# Altium project smart_car.PrjPcb
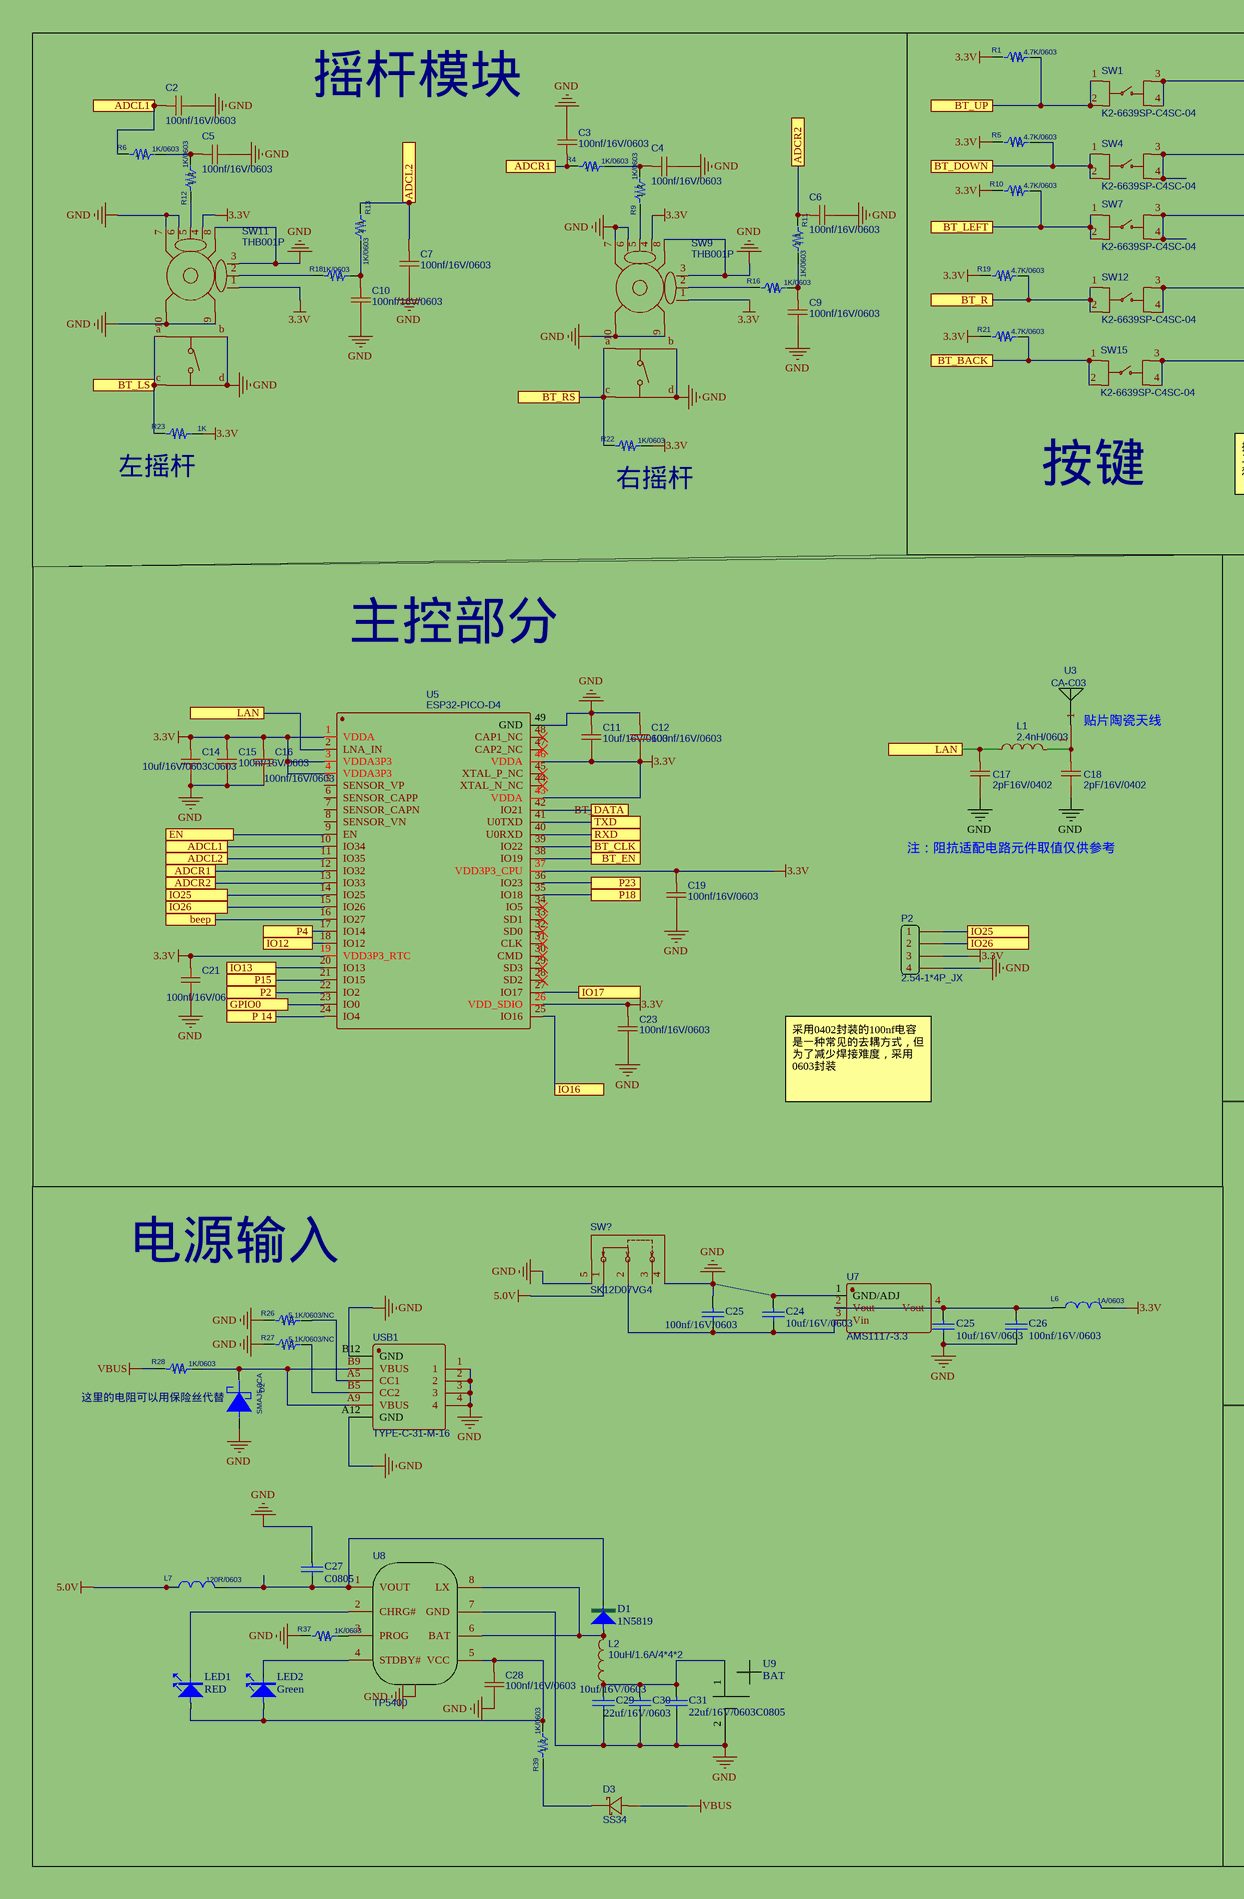
[diagram p0: 遥控器.SchDoc, left]
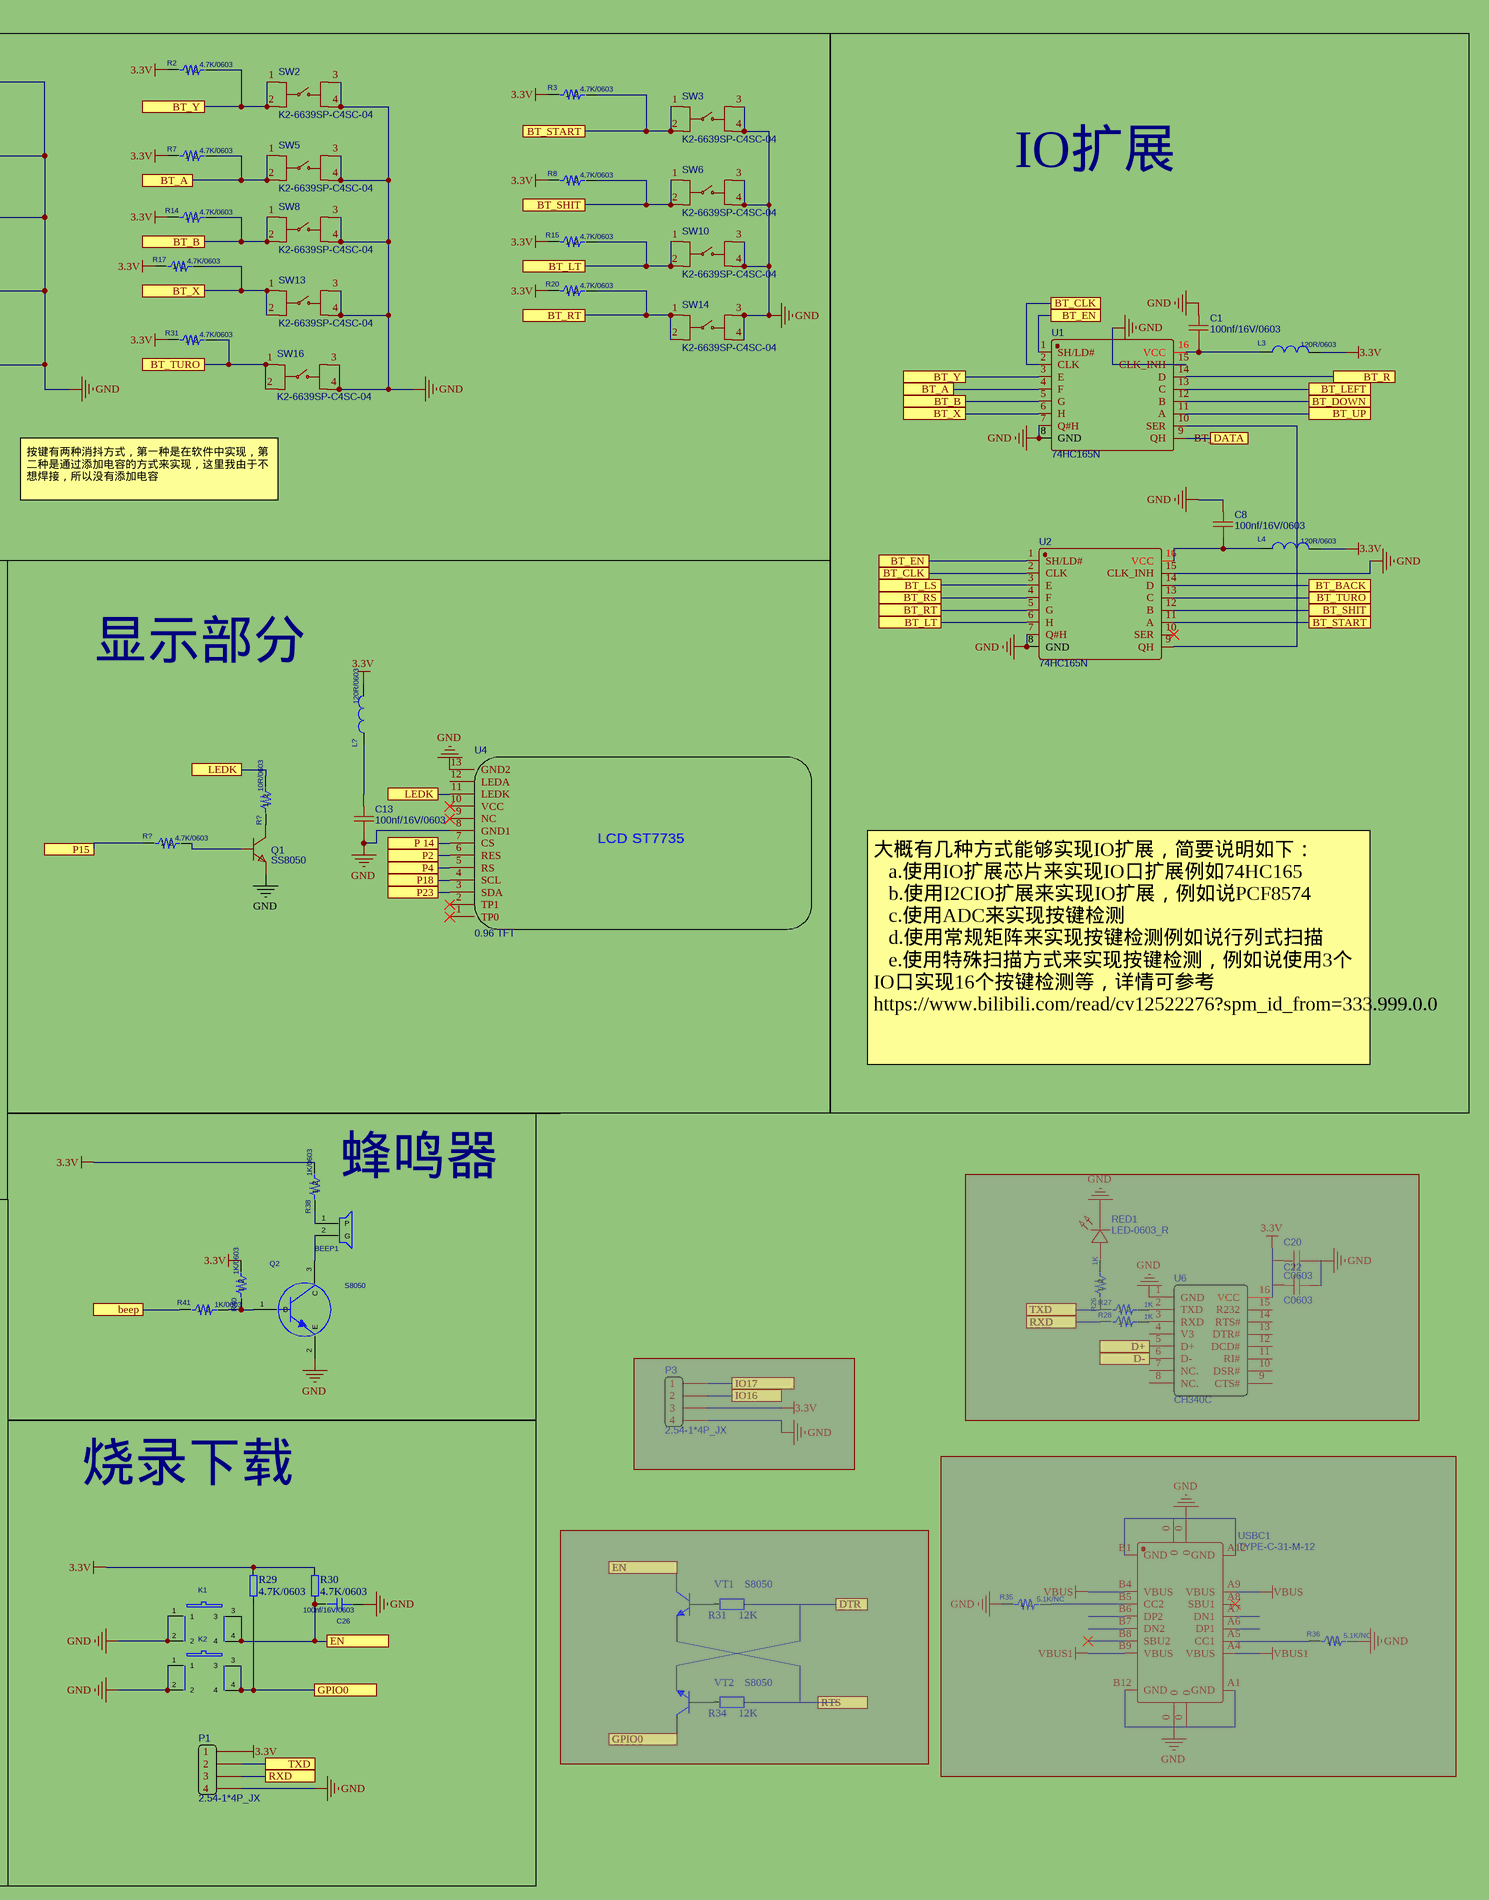
[diagram p1: 遥控器.SchDoc, right]
1 sheet, 127 parts. Net scope: flat (ports and power ports of the same name join across sheets).
Board files: PCB2.PcbDoc, PCB3.PcbDoc, 个人logo.PcbDoc

## Sheet 遥控器.SchDoc
size A2

### Parts
(Parts that share a designator on the sheet are numbered #1, #2 ... from top to bottom, then left to right.)
BEEP1  BEEP-9.5X5.5  [BEEP-9.5X5.5]  (value not drawn)
C1  100nf/16V/0603  [C0603]
C2  100nf/16V/0603  [C0603]
C3  100nf/16V/0603  [C0603]
C4  100nf/16V/0603  [C0603]
C5  100nf/16V/0603  [C0603]
C6  100nf/16V/0603  [C0603]
C7  100nf/16V/0603  [C0603]
C8  100nf/16V/0603  [C0603]
C9  100nf/16V/0603  [C0603]
C10  100nf/16V/0603  [C0603]
C11  10uf/16V/0603  [C0603]
C12  100nf/16V/0603  [C0603]
C13  100nf/16V/0603  [C0603]
C14  10uf/16V/0603C0603  [C0603]
C15  100nf/16V/0603  [C0603]
C16  100nf/16V/0603  [C0603]
C17  2pF16V/0402  [C0402]
C18  2pF/16V/0402  [C0402]
C19  100nf/16V/0603  [C0603]
C20  C0603  [C0603]  (masked out: inside a compile mask, not in the netlist)
C21  100nf/16V/0603  [C0603]
C22  C0603  [C0603]  (masked out: inside a compile mask, not in the netlist)
C23  100nf/16V/0603  [C0603]
C24  10uf/16V/0603  [C0805]
C25#1  100nf/16V/0603  [C0805]
C25#2  10uf/16V/0603  [C0805]
C26#1  100nf/16V/0603  [C0805]
C26#2  value 100nf/16V/0603  [C0402]  (hidden comment: C0402)
C27  C0805  [C0805]
C28  100nf/16V/0603  [C0603]
C29  10uf/16V/0603  [C0805]
C30  22uf/16V/0603  [C0805]
C31  22uf/16V/0603C0805  [C0805]
D1  1N5819  [SOD-323]
D2  SMAJ5.0CA  [DO-214]
D3  SS34  [SMA_L4.2-W2.7-LS5.0-RD]
K1  KEY  [SW6.2/6.2-SMD]  (value not drawn)
K2  KEY  [SW6.2/6.2-SMD]  (value not drawn)
L1  2.4nH/0603  [L0603]
L2  10uH/1.6A/4*4*2  [IND-SMD_L4.0-W4.0]
L3  value 120R/0603  [L0603]  (hidden comment: L0603)
L4  value 120R/0603  [L0603]  (hidden comment: L0603)
L6  value 1A/0603  [L0603]  (hidden comment: L0603)
L7  value 120R/0603  [L0603]  (hidden comment: L0603)
L?  value 120R/0603  [L0603]  (hidden comment: L0603)
LED1  RED  [LED0805_RED]
LED2  Green  [LED0805_RED]
P1  2.54-1*4P_JX  [2.54-1*4P_TIGHT_JX]
P2  2.54-1*4P_JX  [2.54-1*4P_TIGHT_JX]
P3  2.54-1*4P_JX  [2.54-1*4P_TIGHT_JX]  (masked out: inside a compile mask, not in the netlist)
Q1  SS8050  [SOT-23-3_L2.9-W1.3-P1.90-LS2.4-BR]
Q2  S8050  [SOT-23]
R1  value 4.7K/0603  [R_0603]  (hidden comment: R0603)
R2  value 4.7K/0603  [R_0603]  (hidden comment: R0603)
R3  value 4.7K/0603  [R_0603]  (hidden comment: R0603)
R4  value 1K/0603  [R_0603]  (hidden comment: R0603)
R5  value 4.7K/0603  [R_0603]  (hidden comment: R0603)
R6  value 1K/0603  [R_0603]  (hidden comment: R0603)
R7  value 4.7K/0603  [R_0603]  (hidden comment: R0603)
R8  value 4.7K/0603  [R_0603]  (hidden comment: R0603)
R9  value 1K/0603  [R_0603]  (hidden comment: R0603)
R10  value 4.7K/0603  [R_0603]  (hidden comment: R0603)
R11  value 1K/0603  [R_0603]  (hidden comment: R0603)
R12  value 1K/0603  [R_0603]  (hidden comment: R0603)
R13  value 1K/0603  [R_0603]  (hidden comment: R0603)
R14  value 4.7K/0603  [R_0603]  (hidden comment: R0603)
R15  value 4.7K/0603  [R_0603]  (hidden comment: R0603)
R16  value 1K/0603  [R_0603]  (hidden comment: R0603)
R17  value 4.7K/0603  [R_0603]  (hidden comment: R0603)
R18  value 1K/0603  [R_0603]  (hidden comment: R0603)
R19  value 4.7K/0603  [R_0603]  (hidden comment: R0603)
R20  value 4.7K/0603  [R_0603]  (hidden comment: R0603)
R21  value 4.7K/0603  [R_0603]  (hidden comment: R0603)
R22  value 1K/0603  [R_0603]  (hidden comment: R0603)
R23  value 1K  [R_0603]  (hidden comment: R0603)
R26#1  value 1K  [R_0603]  (hidden comment: R0603)  (masked out: inside a compile mask, not in the netlist)
R26#2  value 5.1K/0603/NC  [R_0603]  (hidden comment: R0603)
R27#1  value 1K  [R_0603]  (hidden comment: R0603)  (masked out: inside a compile mask, not in the netlist)
R27#2  value 5.1K/0603/NC  [R_0603]  (hidden comment: R0603)
R28#1  value 1K  [R_0603]  (hidden comment: R0603)  (masked out: inside a compile mask, not in the netlist)
R28#2  value 1K/0603  [R0805]  (hidden comment: R0603)
R29  4.7K/0603  [R0402]
R30  4.7K/0603  [R0402]
R31#1  value 4.7K/0603  [R_0603]  (hidden comment: R0603)
R31#2  12K  [R0402]  (masked out: inside a compile mask, not in the netlist)
R34  12K  [R0402]  (masked out: inside a compile mask, not in the netlist)
R35  value 5.1K/NC  [R_0603]  (hidden comment: R0603)  (masked out: inside a compile mask, not in the netlist)
R36  value 5.1K/NC  [R_0603]  (hidden comment: R0603)  (masked out: inside a compile mask, not in the netlist)
R37  value 1K/0603  [R_0603]  (hidden comment: R0603)
R38  value 1K/0603  [R_0603]  (hidden comment: R0603)
R39  value 1K/0603  [R_0603]  (hidden comment: R0603)
R40  value 1K/0603  [R_0603]  (hidden comment: R0603)
R41  value 1K/0603  [R_0603]  (hidden comment: R0603)
R?#1  value 10R/0603  [R_0603]  (hidden comment: R0603)
R?#2  value 4.7K/0603  [R_0603]  (hidden comment: R0603)
RED1  LED-0603_R  [LED0603_RED]  (masked out: inside a compile mask, not in the netlist)
SW1  K2-6639SP-C4SC-04  [KEY-SMD_4P-L6.0-W6.0-P3.90-LS10.0]
SW2  K2-6639SP-C4SC-04  [KEY-SMD_4P-L6.0-W6.0-P3.90-LS10.0]
SW3  K2-6639SP-C4SC-04  [KEY-SMD_4P-L6.0-W6.0-P3.90-LS10.0]
SW4  K2-6639SP-C4SC-04  [KEY-SMD_4P-L6.0-W6.0-P3.90-LS10.0]
SW5  K2-6639SP-C4SC-04  [KEY-SMD_4P-L6.0-W6.0-P3.90-LS10.0]
SW6  K2-6639SP-C4SC-04  [KEY-SMD_4P-L6.0-W6.0-P3.90-LS10.0]
SW7  K2-6639SP-C4SC-04  [KEY-SMD_4P-L6.0-W6.0-P3.90-LS10.0]
SW8  K2-6639SP-C4SC-04  [KEY-SMD_4P-L6.0-W6.0-P3.90-LS10.0]
SW9  THB001P  [SW-TH_THB001P]
SW10  K2-6639SP-C4SC-04  [SW-TH_KH-6X6X9H-ZJ]
SW11  THB001P  [SW-TH_THB001P]
SW12  K2-6639SP-C4SC-04  [KEY-SMD_4P-L6.0-W6.0-P3.90-LS10.0]
SW13  K2-6639SP-C4SC-04  [KEY-SMD_4P-L6.0-W6.0-P3.90-LS10.0]
SW14  K2-6639SP-C4SC-04  [SW-TH_KH-6X6X9H-ZJ]
SW15  K2-6639SP-C4SC-04  [KEY-SMD_4P-L6.0-W6.0-P3.90-LS10.0]
SW16  K2-6639SP-C4SC-04  [KEY-SMD_4P-L6.0-W6.0-P3.90-LS10.0]
SW?  SK12D07VG4  [SW-TH_SK12D07VG4]
U1  74HC165N  [SOP-16_L9.9-W3.9-P1.27-LS6.1-BL]
U2  74HC165N  [SOP-16_L9.9-W3.9-P1.27-LS6.1-BL]
U3  CA-C03  [ANT2051]
U4  0.96 TFT  [0.96 LCD]
U5  ESP32-PICO-D4  [QFN-48_L7.0-W7.0-P0.50-BL-EP5.4]
U6  CH340C  [SOP-16_L10.0-W3.9-P1.27-LS6.0-BL]  (masked out: inside a compile mask, not in the netlist)
U7  AMS1117-3.3  [SOT-223-3_L6.5-W3.4-P2.30-LS7.0-BR]
U8  TP5400  [SOIC-8_L5.0-W4.0-P1.27-LS6.0-BL-EP2.0]
U9  BAT  [C1206]
USB1  TYPE-C-31-M-16  [TYPE-C-SMD_TYPE-C-31-M-16]
USBC1  TYPE-C-31-M-12  [USB-C_SMD-TYPE-C-31-M-12]  (masked out: inside a compile mask, not in the netlist)
VT1  S8050  [SOT-23]  (masked out: inside a compile mask, not in the netlist)
VT2  S8050  [SOT-23]  (masked out: inside a compile mask, not in the netlist)

### Blocks framed on the sheet
摇杆模块: C2-C7 C9 C10 R4 R6 R9 R11-R13 R16 R18 R22 R23 SW9 SW11
IO扩展: C1 C8 L3 L4 U1 U2
主控部分: C11 C12 C14-C19 C21 C23 L1 P2 U3 U5
电源输入: C24 C25#1 C25#2 C26#1 C27-C31 D1-D3 L2 L6 L7 LED1 LED2 R26#2 R27#2 R28#2 R37 R39 SW? U7-U9 USB1

### Ports
ADCL1, ADCL2, ADCR1, ADCR2, beep, BT_A, BT_B, BT_BACK, BT_CLK, BT_DATA, BT_DOWN, BT_EN, BT_LEFT, BT_LS, BT_LT, BT_R, BT_RS, BT_RT, BT_SHIT, BT_START, BT_TURO, BT_UP, BT_X, BT_Y, D+, D-, DTR, EN, GPIO0, IO12, IO13, IO16, IO17, IO25, IO26, LAN, LEDK, P2, P4, P15, P18, P23, P 14, RTS, RXD, TXD

### Nets
3.3V: C11.1 C12.1 C14.2 C15.2 C16.2 C19.2 C21.2 C23.2 L3.2 L4.2 L6.2 L?.2 P1.1 P2.3 R1.1 R2.1 R3.1 R5.1 R7.1 R8.1 R10.1 R14.1 R15.1 R17.1 R19.1 R20.1 R21.1 R22.2 R23.2 R29.2 R30.2 R31#1.1 R38.2 R40.2 SW9.1(B) SW9.4(A) SW11.1(B) SW11.4(A) U5.1(VDDA) U5.3(VDDA3P3) U5.4(VDDA3P3) U5.19(VDD3P3_RTC) U5.26(VDD_SDIO) U5.37(VDD3P3_CPU) U5.43(VDDA) U5.46(VDDA)
5.0V: L7.1 SW?.1
GND: C1.2 C2.1 C3.1 C4.1 C5.1 C6.1 C7.1 C8.2 C9.1 C10.1 C11.2 C12.2 C13.1 C14.1 C15.1 C16.1 C17.1 C18.1 C19.1 C21.1 C23.1 C24.1 C25#1.1 C25#2.2 C26#1.2 C26#2.1 C27.1 C28.1 C29.2 C30.2 C31.2 D2.1(+) K1.1 K1.2 K2.1 K2.2 P1.4 P2.4 Q1.2(E) Q2.2(E) R26#2.1 R27#2.1 R37.1 SW1.3 SW1.4 SW2.3 SW2.4 SW3.3 SW3.4 SW4.3 SW4.4 SW5.3 SW5.4 SW6.3 SW6.4 SW7.3 SW7.4 SW8.3 SW8.4 SW9.3(A) SW9.6(B) SW9.7(GND) SW9.8(GND) SW9.9(GND) SW9.10(GND) SW9.b SW9.d SW10.3 SW10.4 SW11.3(A) SW11.6(B) SW11.7(GND) SW11.8(GND) SW11.9(GND) SW11.10(GND) SW11.b SW11.d SW12.3 SW12.4 SW13.3 SW13.4 SW14.3 SW14.4 SW15.3 SW15.4 SW16.3 SW16.4 SW?.4 SW?.5 U1.7(Q#H) U1.8(GND) U1.15(CLK_INH) U2.7(Q#H) U2.8(GND) U2.15(CLK_INH) U4.8(GND1) U4.13(GND2) U5.49(GND) U7.1(GND/ADJ) U8.7(GND) U8.9 U9.2(-) USB1.1 USB1.2 USB1.3 USB1.4 USB1.A12(GND) USB1.B12(GND)
VBUS: D3.2 R28#2.1
NetBEEP1_1: BEEP1.1(P) R38.1
NetBEEP1_2: BEEP1.2(G) Q2.3(C)
NetC1_1: C1.1 L3.1 U1.16(VCC)
NetC2_2: C2.2 R6.1 U5.10(IO34) ; port ADCL1
NetC3_2: C3.2 R4.1 U5.12(IO32) ; port ADCR1
NetC4_2: C4.2 R4.2 R9.2
NetC5_2: C5.2 R6.2 R12.2
NetC6_2: C6.2 R11.1 U5.13(IO33) ; port ADCR2
NetC7_2: C7.2 R13.1 U5.11(IO35) ; port ADCL2
NetC8_1: C8.1 L4.1 U2.16(VCC)
NetC9_2: C9.2 R11.2 R16.2
NetC10_2: C10.2 R13.2 R18.2
NetC13_2: C13.2 L?.1
NetC17_2: C17.2 L1.1 U5.2(LNA_IN) ; port LAN
NetC18_2: C18.2 L1.2 U3.1
NetC24_2: C24.2 C25#1.2 SW?.2 U7.3(Vin)
NetC25#2_1: C25#2.1 C26#1.1 L6.1 U7.2(Vout) U7.4(Vout)
NetC26#2_2: C26#2.2 K1.3 K1.4 R30.1 U5.9(EN) ; port EN
NetC27_2: C27.2 D1.2 L7.2 U8.1(VOUT)
NetC28_2: C28.2 LED1.1 LED2.1 R39.2 U8.5(VCC)
NetC29_1: C29.1 C30.1 C31.1 L2.1 U9.1(+)
NetD1_1: D1.1 L2.2 U8.6(BAT) U8.8(LX)
NetD2_2: D2.2(-) R28#2.2 USB1.A9(VBUS) USB1.B9(VBUS)
NetD3_1: D3.1 R39.1
NetK2_3: K2.3 K2.4 R29.1 U5.23(IO0) ; port GPIO0
NetLED1_2: LED1.2 U8.2(CHRG#)
NetLED2_2: LED2.2 U8.4(STDBY#)
NetP1_2: P1.2 U5.41(U0TXD) ; port TXD
NetP1_3: P1.3 U5.40(U0RXD) ; port RXD
NetP2_1: P2.1 U5.14(IO25) ; port IO25
NetP2_2: P2.2 U5.15(IO26) ; port IO26
NetQ1_1: Q1.1(B) R?#2.2
NetQ1_3: Q1.3(C) R?#1.1
NetQ2_1: Q2.1(B) R40.1 R41.2
NetR1_2: R1.2 SW1.1 SW1.2 U1.11(A) ; port BT_UP
NetR2_2: R2.2 SW2.1 SW2.2 U1.3(E) ; port BT_Y
NetR3_2: R3.2 SW3.1 SW3.2 U2.11(A) ; port BT_START
NetR5_2: R5.2 SW4.1 SW4.2 U1.12(B) ; port BT_DOWN
NetR7_2: R7.2 SW5.1 SW5.2 U1.4(F) ; port BT_A
NetR8_2: R8.2 SW6.1 SW6.2 U2.12(B) ; port BT_SHIT
NetR9_1: R9.1 SW9.5(DTA)
NetR10_2: R10.2 SW7.1 SW7.2 U1.13(C) ; port BT_LEFT
NetR12_1: R12.1 SW11.5(DTA)
NetR14_2: R14.2 SW8.1 SW8.2 U1.5(G) ; port BT_B
NetR15_2: R15.2 SW10.1 SW10.2 U2.6(H) ; port BT_LT
NetR16_1: R16.1 SW9.2(DTA)
NetR17_2: R17.2 SW13.1 SW13.2 U1.6(H) ; port BT_X
NetR18_1: R18.1 SW11.2(DTA)
NetR19_2: R19.2 SW12.1 SW12.2 U1.14(D) ; port BT_R
NetR20_2: R20.2 SW14.1 SW14.2 U2.5(G) ; port BT_RT
NetR21_2: R21.2 SW15.1 SW15.2 U2.14(D) ; port BT_BACK
NetR22_1: R22.1 SW9.a SW9.c U2.4(F) ; port BT_RS
NetR23_1: R23.1 SW11.a SW11.c U2.3(E) ; port BT_LS
NetR26#2_2: R26#2.2 USB1.A5(CC1)
NetR27#2_2: R27#2.2 USB1.B5(CC2)
NetR31#1_2: R31#1.2 SW16.1 SW16.2 U2.13(C) ; port BT_TURO
NetR37_2: R37.2 U8.3(PROG)
NetR41_1: R41.1 U5.16(IO27) ; port beep
NetR?#1_2: R?#1.2 U4.11(LEDK) ; port LEDK
NetR?#2_1: R?#2.1 U5.21(IO15) ; port P15
NetU1_1: U1.1(SH/LD#) U2.1(SH/LD#) U5.38(IO19) ; port BT_EN
NetU1_2: U1.2(CLK) U2.2(CLK) U5.39(IO22) ; port BT_CLK
NetU1_9: U1.9(QH) U5.42(IO21) ; port BT_DATA
NetU1_10: U1.10(SER) U2.9(QH)
NetU4_3: U4.3(SDA) U5.36(IO23) ; port P23
NetU4_4: U4.4(SCL) U5.35(IO18) ; port P18
NetU4_5: U4.5(RS) U5.17(IO14) ; port P4
NetU4_6: U4.6(RES) U5.22(IO2) ; port P2
NetU4_7: U4.7(CS) U5.24(IO4) ; port P 14
NetU5_18: U5.18(IO12) ; port IO12
NetU5_20: U5.20(IO13) ; port IO13
NetU5_25: U5.25(IO16) ; port IO16
NetU5_27: U5.27(IO17) ; port IO17

Not connected (* = marked no-connect by the designer): SW? 3; U2 10(SER)*; U4 1(TP0)* 2(TP1)* 9(NC)* 10(VCC)* 12(LEDA); U5 5(SENSOR_VP) 6(SENSOR_CAPP) 7(SENSOR_CAPN) 8(SENSOR_VN) 28(SD2)* 29(SD3)* 30(CMD)* 31(CLK)* 32(SD0)* 33(SD1)* 34(IO5)* 44(XTAL_N_NC)* 45(XTAL_P_NC)* 47(CAP2_NC)* 48(CAP1_NC)*

### Notes on the sheet
- (near R23) 左摇杆
- (near R22) 右摇杆
- 按键
- 按键有两种消抖方式，第一种是在软件中实现，第二种是通过添加电容的方式来实现，这里我由于不想焊接，所以没有添加电容
- 显示部分
- 注：阻抗适配电路元件取值仅供参考
- 大概有几种方式能够实现IO扩展，简要说明如下：
  a.使用IO扩展芯片来实现IO口扩展例如74HC165
  b.使用I2CIO扩展来实现IO扩展，例如说PCF8574
  c.使用ADC来实现按键检测
  d.使用常规矩阵来实现按键检测例如说行列式扫描
  e.使用特殊扫描方式来实现按键检测，例如说使用3个IO口实现16个按键检测等，详情可参考https://www.bilibili.com/read/cv12522276?spm_id_from=333.999.0.0
- 采用0402封装的100nf电容是一种常见的去耦方式，但为了减少焊接难度，采用0603封装
- 蜂鸣器
- (near R28#2) 这里的电阻可以用保险丝代替
- 烧录下载
- (in symbol 0.96 TFT) LCD ST7735
- (in symbol CA-C03) 贴片陶瓷天线

### Library data of the parts
C1-C16 C19-C23 C28 = C0603: BOM_Manufacturer: Samsung Electro-Mechanics; BOM_Manufacturer Part: 10uF; nameAlias: Value; Contributor: LCSC; BOM_Supplier: LCSC; BOM_Supplier Part: C15415; spicePre: C; spiceSymbolName: 10UF
C17 C18 = 2pF: nameAlias: Value(F); Contributor: LCEDA_Lib; spicePre: C; spiceSymbolName: C_0402_US
C24 C25#1 C25#2 C26#1 C27 C29-C31 = C0805: Capacitor
C26#2 = C0402: PCB DECAL: CAP_0603_FIRE
D1 = 1N5819: 肖特基二极管
D2 = SMAJ5.0CA: 500V  400W 稳压管; PCB DECAL: DO-214; Value: SMAJ5.0CA
D3 = SS34_C2909963: BOM_Manufacturer: YONGYUTAI(永裕泰); Contributor: LCSC; BOM_Supplier: LCSC; BOM_Supplier Part: C2909963; BOM_Manufacturer Part: SS34; BOM_JLCPCB Part Class: Extended Part; spicePre: D; spiceSymbolName: SS34_C2909963
L1 = 2.4nH: nameAlias: Value(H); Contributor: LCEDA_Lib; spicePre: L; spiceSymbolName: L0402_US
L2 = 10uH: BOM_Manufacturer: Sunlord; BOM_Manufacturer Part: SWPA4030S100MT; nameAlias: Inductance; BOM_Supplier: LCSC; BOM_Supplier Part: C38117; BOM_JLCPCB Part Class: Extended Part; spicePre: L; spiceSymbolName: SWPA4030S100MT
L3 L4 L6 L7 L? = L0603: 0603,BEAD; Manufacturer #1 PN: BEAD; PCB DECAL: L0603
LED1 LED2 = LED_B
Q1 = SS8050: BOM_Manufacturer: FUXINSEMI; Contributor: LCSC; BOM_Supplier: LCSC; BOM_Supplier Part: C908250; BOM_Manufacturer Part: SS8050; BOM_JLCPCB Part Class: Extended Part; spicePre: Q; spiceSymbolName: SS8050
Q2 = S8050: NPN; Manufacturer #2: 8050; PCB DECAL: SOT-23
R28#2 = R0603: PCB DECAL: R_0603
R29 R30 = R0402
R31#2 R34 = 电阻-0402: Resistor; Value: 22R
RED1 = LED-0603_R: BOM_Manufacturer: EVERLIGHT(台湾亿光); BOM_Manufacturer Part: 19-217/R6C-AL1M2VY/3T; Contributor: LCEDA_01; BOM_Supplier Part: C72044; BOM_Supplier: LCSC; spicePre: L; spiceSymbolName: LED-0603_R
SW1-SW8 SW10 SW12-SW16 = K2-6639SP-C4SC-04: BOM_Manufacturer: HRO; BOM_Supplier: LCSC; BOM_Manufacturer Part: K2-6639SP-C4SC-04; BOM_Supplier Part: C83206; BOM_JLCPCB Part Class: Extended Part; spicePre: S; spiceSymbolName: K2-6639SP-C4SC-04
SW9 SW11 = THB001P: 摇杆开关; BOM_Manufacturer: C&K; Contributor: LCSC; BOM_Supplier: LCSC; BOM_Supplier Part: C2685355; BOM_Manufacturer Part: THB001P; BOM_JLCPCB Part Class: Extended Part; spicePre: S; spiceSymbolName: THB001P
SW? = SW-bodong: 拨动开关; BOM_Manufacturer: SHOU HAN; Contributor: LCSC; BOM_Supplier: LCSC; BOM_Supplier Part: C393937; BOM_Manufacturer Part: SK12D07VG4; BOM_JLCPCB Part Class: Extended Part; spicePre: S; spiceSymbolName: SK12D07VG4
U1 U2 = 74HC165N: 8位并行输入 输出寄存器; BOM_Manufacturer: HGSEMI; Contributor: LCSC; BOM_Supplier: LCSC; BOM_Supplier Part: C507183; BOM_Manufacturer Part: 74HC165N; BOM_JLCPCB Part Class: Extended Part; spicePre: U; spiceSymbolName: 74HC165N
U3 = CA-C03: Contributor: BVREAVE; link: https://item.taobao.com/item.htm?spm=a230r.1.14.4.81c453c0MSMjjx&id=627328734225&ns=1&abbucket=1#detail; spicePre: U; spiceSymbolName: ANT_CrossAir_CA-C03
U4 = 0.96 TFT: Contributor: FJ956391150; spicePre: U; spiceSymbolName: 0.96 TFT
U5 = ESP32-PICO-D4: BOM_Manufacturer: Espressif Systems; Contributor: LCSC; BOM_Supplier: LCSC; BOM_Supplier Part: C193707; BOM_Manufacturer Part: ESP32-PICO-D4; BOM_JLCPCB Part Class: Extended Part; Frequency: -; spicePre: U; spiceSymbolName: ESP32-PICO-D4
U6 = CH340C: BOM_Manufacturer: WCH; BOM_Supplier: LCSC; BOM_Manufacturer Part: CH340C; BOM_Supplier Part: C84681; BOM_JLCPCB Part Class: Extended Part; spicePre: U; spiceSymbolName: CH340C
U7 = AMS1117-3.3: LDO 800mA; BOM_Manufacturer: AMS; sourceId: dwIGgezVh; timeStamp: 1476261164; BOM_Supplier: LCSC; BOM_Manufacturer Part: AMS1117-3.3; BOM_Supplier Part: C6186; BOM_JLCPCB Part Class: Basic Part; spicePre: U; spiceSymbolName: AMS1117-3.3
U8 = TP5400: 锂电池充放电; BOM_Manufacturer: TOPPOWER; BOM_Supplier: LCSC; BOM_Manufacturer Part: TP5400; BOM_Supplier Part: C24154; BOM_JLCPCB Part Class: Extended Part; spicePre: U; spiceSymbolName: TP5400
USB1 = TYPE-C-31-M-16: BOM_Manufacturer: Korean Hroparts Elec; Contributor: LCSC; BOM_Supplier: LCSC; BOM_Supplier Part: C283541; BOM_Manufacturer Part: TYPE-C-31-M-16; BOM_JLCPCB Part Class: Extended Part; spicePre: U; spiceSymbolName: TYPE-C-31-M-16
USBC1 = TYPE-C-31-M-12: BOM_Manufacturer: Rectangular Connectors - Contacts; Contributor: LCSC; BOM_Supplier: LCSC; BOM_Supplier Part: C165948; BOM_Manufacturer Part: TYPE-C-31-M-12; spicePre: U; spiceSymbolName: TYPE-C-31-M-12
VT1 VT2 = SMT_TRIODE_NPN: Surface mount NPN transistor, package SOT-23
BEEP1 = BEEP-9.5X5.5: PCB DECAL: BEEP-9.5X5.5
K1 K2 = KEY: Manufacturer #1 PN: KEY; PCB DECAL: SW6.2/6.2-SMD
P1-P3 = 2.54-1*4P_JX: BOM_Supplier Part: C115245; BOM_Supplier: LCSC; spicePre: P; spiceSymbolName: 2.54-1*4P_JX
R1-R23 R26#1 R26#2 R27#1 R27#2 R28#1 R31#1 R35-R41 R?#1 R?#2 = R0603: PCB DECAL: R_0603